# Altium schematic sheet ESP32_CUSTOM.SchDoc
size A2; SheetNumber: 1; SheetTotal: 1
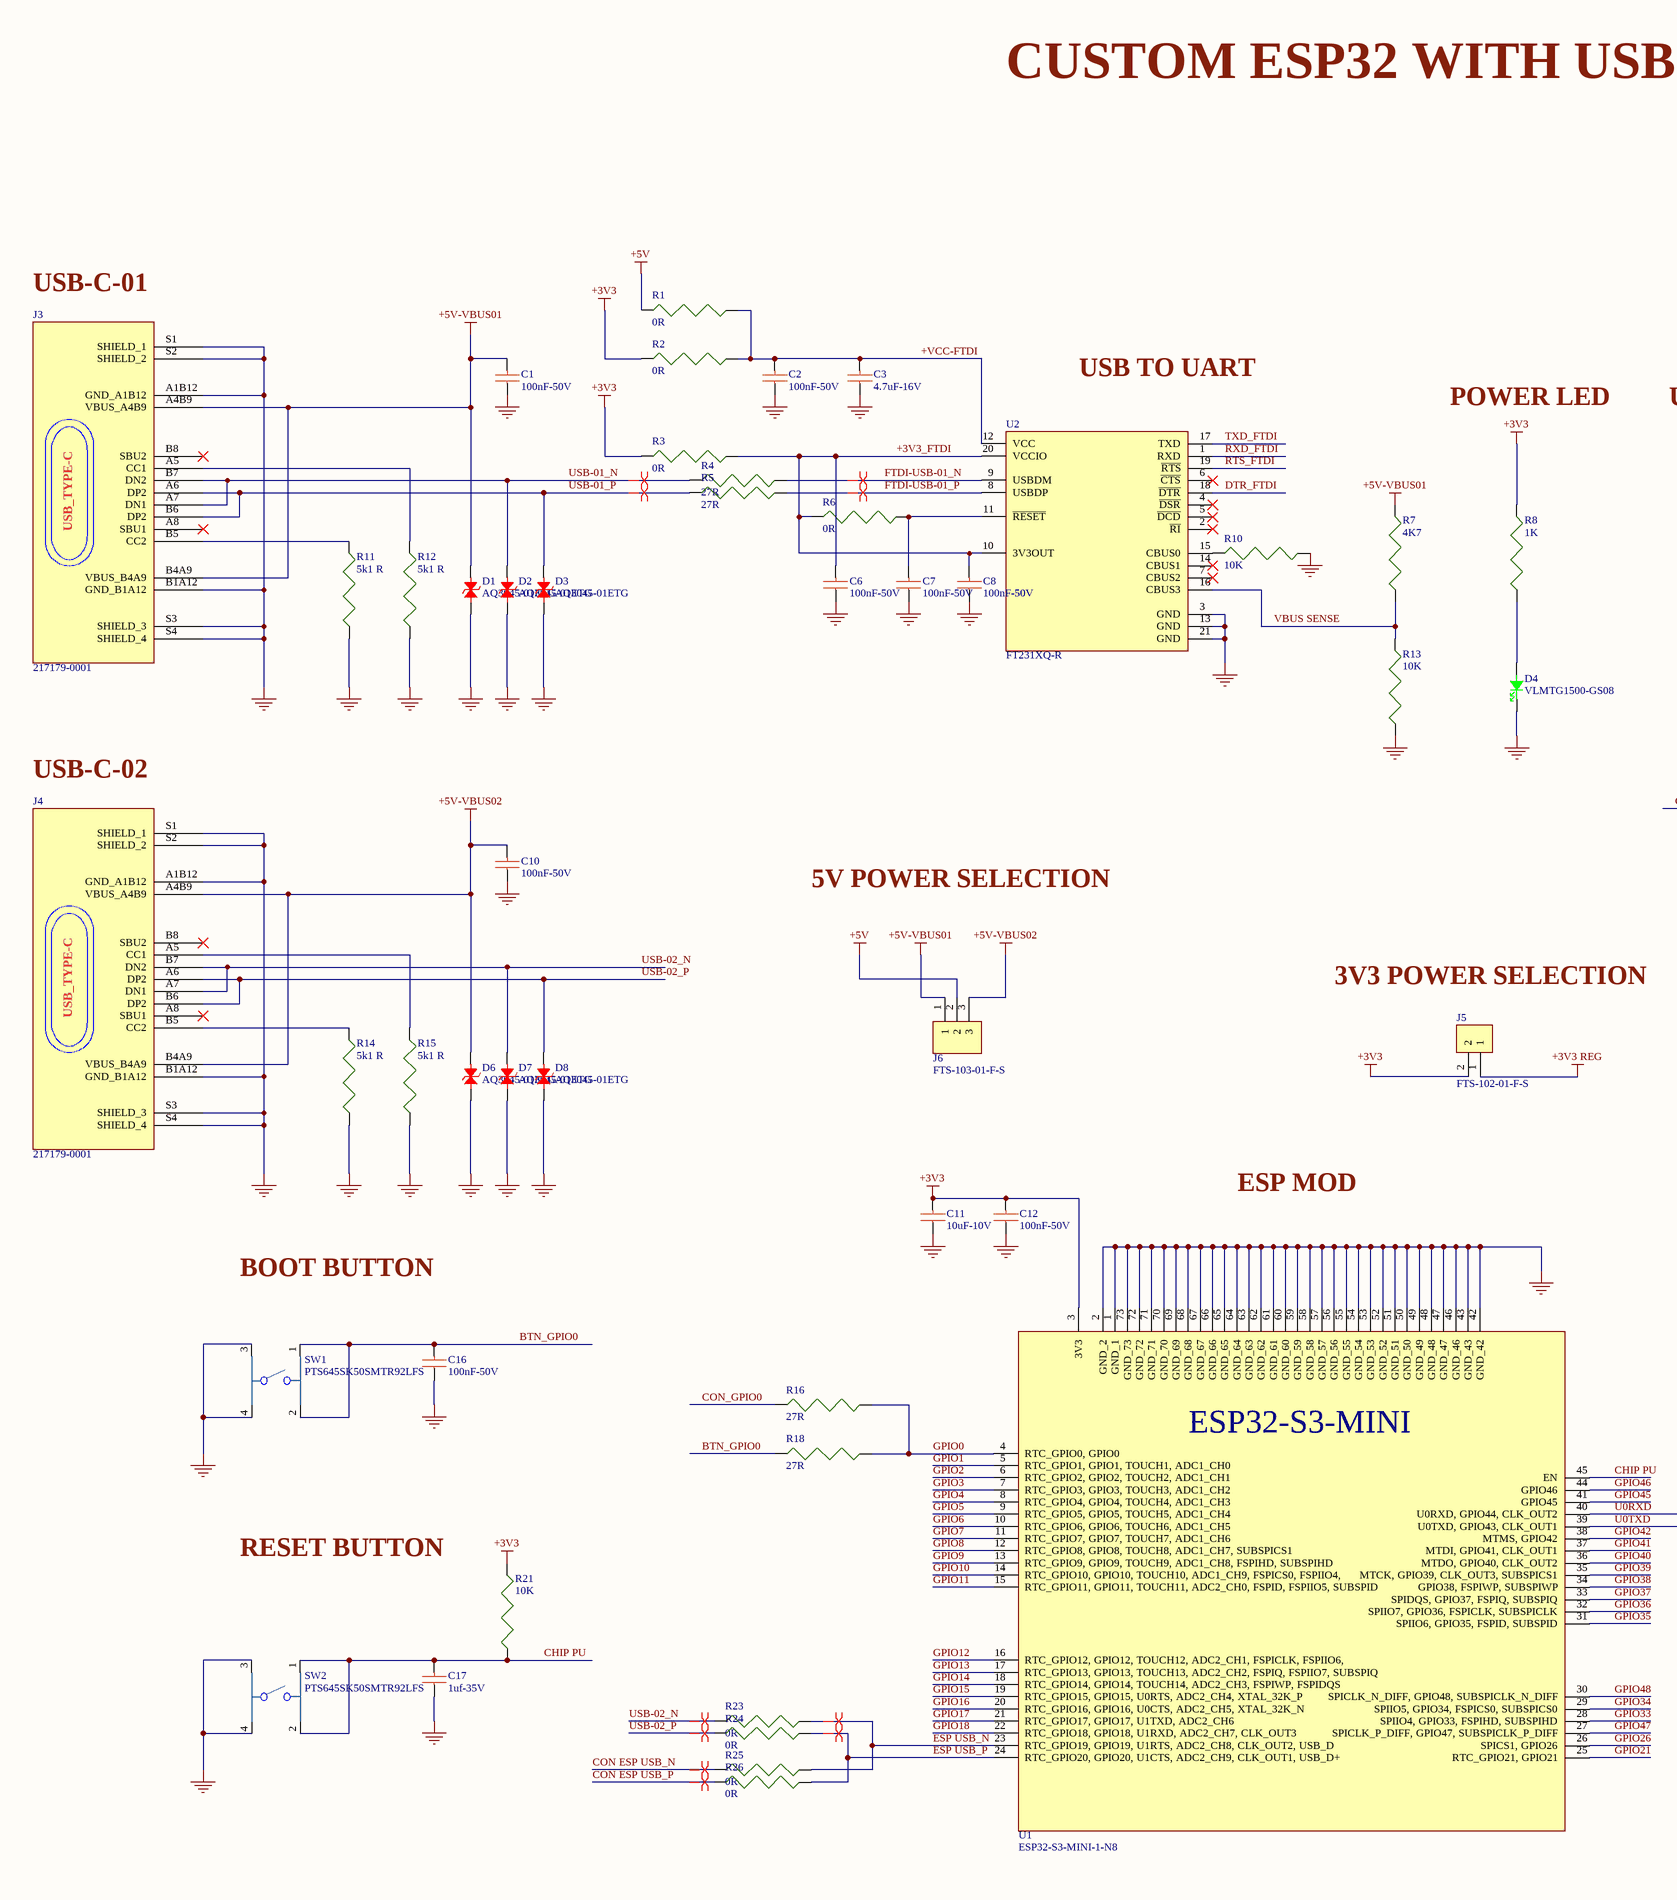
[diagram p0: ESP32_CUSTOM.SchDoc, left]
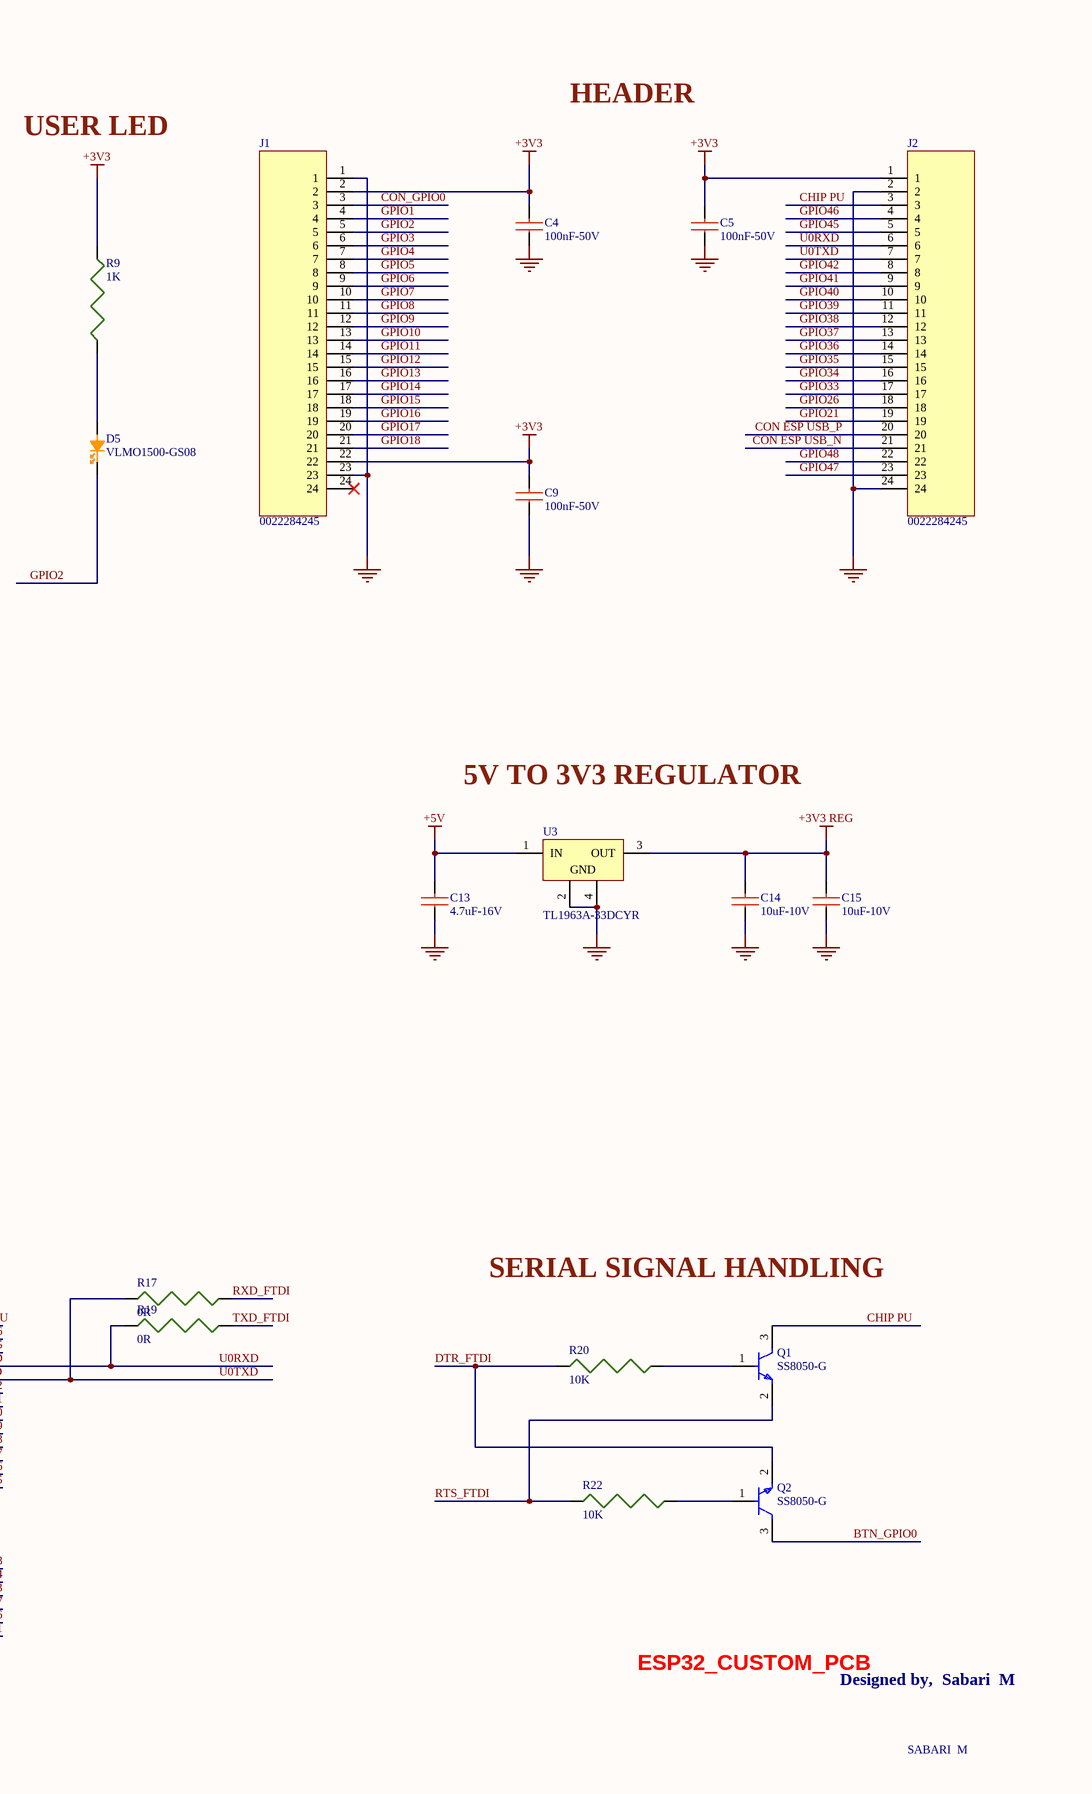
[diagram p1: ESP32_CUSTOM.SchDoc, right]

## Parts
C1  100nF-50V  [FP-CL829-IPC_B]
C2  100nF-50V  [FP-CL829-IPC_B]
C3  4.7uF-16V  [FP-CL829-IPC_B]
C4  100nF-50V  [FP-CL829-IPC_B]
C5  100nF-50V  [FP-CL829-IPC_B]
C6  100nF-50V  [FP-CL829-IPC_B]
C7  100nF-50V  [FP-CL829-IPC_B]
C8  100nF-50V  [FP-CL829-IPC_B]
C9  100nF-50V  [FP-CL829-IPC_B]
C10  100nF-50V  [FP-CL829-IPC_B]
C11  10uF-10V  [FP-CL829-IPC_B]
C12  100nF-50V  [FP-CL829-IPC_B]
C13  4.7uF-16V  [FP-CL829-IPC_B]
C14  10uF-10V  [FP-CL829-IPC_B]
C15  10uF-10V  [FP-CL829-IPC_B]
C16  100nF-50V  [FP-CL829-IPC_B]
C17  1uf-35V  [FP-CL829-IPC_B]
D1  AQ3045-01ETG  [SOD882]
D2  AQ3045-01ETG  [SOD882]
D3  AQ3045-01ETG  [SOD882]
D4  VLMTG1500-GS08  [FP-APG1005CGC-T-MFG]
D5  VLMO1500-GS08  [FP-VLMO1500-GS08-MFG]
D6  AQ3045-01ETG  [SOD882]
D7  AQ3045-01ETG  [SOD882]
D8  AQ3045-01ETG  [SOD882]
J1  0022284245  [HDR_1X24_2.54MM]
J2  0022284245  [HDR_1X24_2.54MM]
J3  217179-0001  [FP-2171790001-MFG]
J4  217179-0001  [FP-2171790001-MFG]
J5  FTS-102-01-F-S  [HDR_1X2_1.27MM]
J6  FTS-103-01-F-S  [HDR_1X3_1.27MM]
Q1  SS8050-G  [FP-SS8050-G-IPC_B]
Q2  SS8050-G  [FP-SS8050-G-IPC_B]
R1  0R  [FP-AC0402-IPC_A]
R2  0R  [FP-AC0402-IPC_A]
R3  0R  [FP-AC0402-IPC_A]
R4  27R  [FP-AC0402-IPC_A]
R5  27R  [FP-AC0402-IPC_A]
R6  0R  [FP-AC0402-IPC_A]
R7  4K7  [FP-AC0402-IPC_A]
R8  1K  [FP-AC0402-IPC_A]
R9  1K  [FP-AC0402-IPC_A]
R10  10K  [FP-AC0402-IPC_A]
R11  5k1 R  [FP-AC0402-IPC_A]
R12  5k1 R  [FP-AC0402-IPC_A]
R13  10K  [FP-AC0402-IPC_A]
R14  5k1 R  [FP-AC0402-IPC_A]
R15  5k1 R  [FP-AC0402-IPC_A]
R16  27R  [FP-AC0402-IPC_A]
R17  0R  [FP-AC0402-IPC_A]
R18  27R  [FP-AC0402-IPC_A]
R19  0R  [FP-AC0402-IPC_A]
R20  10K  [FP-AC0402-IPC_A]
R21  10K  [FP-AC0402-IPC_A]
R22  10K  [FP-AC0402-IPC_A]
R23  0R  [FP-AC0402-IPC_A]
R24  0R  [FP-AC0402-IPC_A]
R25  0R  [FP-AC0402-IPC_A]
R26  0R  [FP-AC0402-IPC_A]
SW1  PTS645SK50SMTR92LFS  [FP-PTS645SM43SMTR92LFS-MFG]
SW2  PTS645SK50SMTR92LFS  [FP-PTS645SM43SMTR92LFS-MFG]
U1  ESP32-S3-MINI-1-N8  [XCVR_ESP32-S3-MINI-1-N8]
U2  FT231XQ-R  [FP-QFN-20-IPC_B]
U3  TL1963A-33DCYR  [DCY0004A_N]

## Nets
+3V3: C4.2 C5.2 C9.2 C11.2 C12.2 J1.2 J1.22 J2.1 J5.2 R2.1 R3.1 R8.2 R9.2 R21.1 U1.3(3V3)
+3V3 REG: C14.2 C15.2 J5.1 U3.3(OUT)
+5V: C13.2 J6.2 R1.1 U3.1(IN)
+5V-VBUS01: C1.2 D1.1 J3.A4B9(VBUS_A4B9) J3.B4A9(VBUS_B4A9) J6.1 R7.2
+5V-VBUS02: C10.2 D6.1 J4.A4B9(VBUS_A4B9) J4.B4A9(VBUS_B4A9) J6.3
GND: C1.1 C2.1 C3.1 C4.1 C5.1 C6.1 C7.1 C8.1 C9.1 C10.1 C11.1 C12.1 C13.1 C14.1 C15.1 C16.1 C17.1 D1.2 D2.2 D3.2 D4.1 D6.2 D7.2 D8.2 J1.1 J1.23 J2.2 J2.24 J3.A1B12(GND_A1B12) J3.B1A12(GND_B1A12) J3.S1(SHIELD_1) J3.S2(SHIELD_2) J3.S3(SHIELD_3) J3.S4(SHIELD_4) J4.A1B12(GND_A1B12) J4.B1A12(GND_B1A12) J4.S1(SHIELD_1) J4.S2(SHIELD_2) J4.S3(SHIELD_3) J4.S4(SHIELD_4) R10.1 R11.1 R12.1 R13.1 R14.1 R15.1 SW1.3 SW1.4 SW2.3 SW2.4 U1.1(GND_1) U1.2(GND_2) U1.42(GND_42) U1.43(GND_43) U1.46(GND_46) U1.47(GND_47) U1.48(GND_48) U1.49(GND_49) U1.50(GND_50) U1.51(GND_51) U1.52(GND_52) U1.53(GND_53) U1.54(GND_54) U1.55(GND_55) U1.56(GND_56) U1.57(GND_57) U1.58(GND_58) U1.59(GND_59) U1.60(GND_60) U1.61(GND_61) U1.62(GND_62) U1.63(GND_63) U1.64(GND_64) U1.65(GND_65) U1.66(GND_66) U1.67(GND_67) U1.68(GND_68) U1.69(GND_69) U1.70(GND_70) U1.71(GND_71) U1.72(GND_72) U1.73(GND_73) U2.3(GND) U2.13(GND) U2.21(GND) U3.2(GND) U3.4(GND)
+3V3_FTDI: C6.2 C8.2 R3.2 R6.1 U2.10(3V3OUT) U2.20(VCCIO)
+VCC-FTDI: C2.2 C3.2 R1.2 R2.2 U2.12(VCC)
BTN_GPIO0: C16.2 Q2.3(C) R18.1 SW1.1 SW1.2
CHIP PU: C17.2 J2.3 Q1.3(C) R21.2 SW2.1 SW2.2 U1.45(EN)
CON ESP USB_N: J2.21 R25.1
CON ESP USB_P: J2.20 R26.1
CON_GPIO0: J1.3 R16.1
DTR_FTDI: Q2.2(E) R20.2 U2.18(~{DTR})
ESP USB_N: R23.2 R25.2 U1.23(RTC_GPIO19,_GPIO19,_U1RTS,_ADC2_CH8,_CLK_OUT2,_USB_D)
ESP USB_P: R24.2 R26.2 U1.24(RTC_GPIO20,_GPIO20,_U1CTS,_ADC2_CH9,_CLK_OUT1,_USB_D+)
FTDI-USB-01_N: R4.2 U2.9(USBDM)
FTDI-USB-01_P: R5.2 U2.8(USBDP)
GPIO0: R16.2 R18.2 U1.4(RTC_GPIO0,_GPIO0)
GPIO1: J1.4 U1.5(RTC_GPIO1,_GPIO1,_TOUCH1,_ADC1_CH0)
GPIO2: D5.1 J1.5 U1.6(RTC_GPIO2,_GPIO2,_TOUCH2,_ADC1_CH1)
GPIO3: J1.6 U1.7(RTC_GPIO3,_GPIO3,_TOUCH3,_ADC1_CH2)
GPIO4: J1.7 U1.8(RTC_GPIO4,_GPIO4,_TOUCH4,_ADC1_CH3)
GPIO5: J1.8 U1.9(RTC_GPIO5,_GPIO5,_TOUCH5,_ADC1_CH4)
GPIO6: J1.9 U1.10(RTC_GPIO6,_GPIO6,_TOUCH6,_ADC1_CH5)
GPIO7: J1.10 U1.11(RTC_GPIO7,_GPIO7,_TOUCH7,_ADC1_CH6)
GPIO8: J1.11 U1.12(RTC_GPIO8,_GPIO8,_TOUCH8,_ADC1_CH7,_SUBSPICS1)
GPIO9: J1.12 U1.13(RTC_GPIO9,_GPIO9,_TOUCH9,_ADC1_CH8,_FSPIHD,_SUBSPIHD)
GPIO10: J1.13 U1.14(RTC_GPIO10,_GPIO10,_TOUCH10,_ADC1_CH9,_FSPICS0,_FSPIIO4,)
GPIO11: J1.14 U1.15(RTC_GPIO11,_GPIO11,_TOUCH11,_ADC2_CH0,_FSPID,_FSPIIO5,_SUBSPID)
GPIO12: J1.15 U1.16(RTC_GPIO12,_GPIO12,_TOUCH12,_ADC2_CH1,_FSPICLK,_FSPIIO6,)
GPIO13: J1.16 U1.17(RTC_GPIO13,_GPIO13,_TOUCH13,_ADC2_CH2,_FSPIQ,_FSPIIO7,_SUBSPIQ)
GPIO14: J1.17 U1.18(RTC_GPIO14,_GPIO14,_TOUCH14,_ADC2_CH3,_FSPIWP,_FSPIDQS)
GPIO15: J1.18 U1.19(RTC_GPIO15,_GPIO15,_U0RTS,_ADC2_CH4,_XTAL_32K_P)
GPIO16: J1.19 U1.20(RTC_GPIO16,_GPIO16,_U0CTS,_ADC2_CH5,_XTAL_32K_N)
GPIO17: J1.20 U1.21(RTC_GPIO17,_GPIO17,_U1TXD,_ADC2_CH6)
GPIO18: J1.21 U1.22(RTC_GPIO18,_GPIO18,_U1RXD,_ADC2_CH7,_CLK_OUT3)
GPIO21: J2.19 U1.25(RTC_GPIO21,_GPIO21)
GPIO26: J2.18 U1.26(SPICS1,_GPIO26)
GPIO33: J2.17 U1.28(SPIIO4,_GPIO33,_FSPIHD,_SUBSPIHD)
GPIO34: J2.16 U1.29(SPIIO5,_GPIO34,_FSPICS0,_SUBSPICS0)
GPIO35: J2.15 U1.31(SPIIO6,_GPIO35,_FSPID,_SUBSPID)
GPIO36: J2.14 U1.32(SPIIO7,_GPIO36,_FSPICLK,_SUBSPICLK)
GPIO37: J2.13 U1.33(SPIDQS,_GPIO37,_FSPIQ,_SUBSPIQ)
GPIO38: J2.12 U1.34(GPIO38,_FSPIWP,_SUBSPIWP)
GPIO39: J2.11 U1.35(MTCK,_GPIO39,_CLK_OUT3,_SUBSPICS1)
GPIO40: J2.10 U1.36(MTDO,_GPIO40,_CLK_OUT2)
GPIO41: J2.9 U1.37(MTDI,_GPIO41,_CLK_OUT1)
GPIO42: J2.8 U1.38(MTMS,_GPIO42)
GPIO45: J2.5 U1.41(GPIO45)
GPIO46: J2.4 U1.44(GPIO46)
GPIO47: J2.23 U1.27(SPICLK_P_DIFF,_GPIO47,_SUBSPICLK_P_DIFF)
GPIO48: J2.22 U1.30(SPICLK_N_DIFF,_GPIO48,_SUBSPICLK_N_DIFF)
RTS_FTDI: Q1.2(E) R22.2 U2.19(~{RTS})
RXD_FTDI: R17.2 U2.1(RXD)
TXD_FTDI: R19.2 U2.17(TXD)
U0RXD: J2.6 R19.1 U1.40(U0RXD,_GPIO44,_CLK_OUT2)
U0TXD: J2.7 R17.1 U1.39(U0TXD,_GPIO43,_CLK_OUT1)
USB-01_N: D2.1 J3.A7(DN1) J3.B7(DN2) R4.1
USB-01_P: D3.1 J3.A6(DP2) J3.B6(DP2) R5.1
USB-02_N: D7.1 J4.A7(DN1) J4.B7(DN2) R23.1
USB-02_P: D8.1 J4.A6(DP2) J4.B6(DP2) R24.1
VBUS SENSE: R7.1 R13.2 U2.16(CBUS3)
NetC7_2: C7.2 R6.2 U2.11(~{RESET})
NetD4_2: D4.2 R8.1
NetD5_2: D5.2 R9.1
NetJ3_A5: J3.A5(CC1) R12.2
NetJ3_B5: J3.B5(CC2) R11.2
NetJ4_A5: J4.A5(CC1) R15.2
NetJ4_B5: J4.B5(CC2) R14.2
NetQ1_1: Q1.1(B) R20.1
NetQ2_1: Q2.1(B) R22.1
NetR10_2: R10.2 U2.15(CBUS0)

Not connected (* = marked no-connect by the designer): J1 24*; J3 A8(SBU1)* B8(SBU2)*; J4 A8(SBU1)* B8(SBU2)*; U2 2(~{RI})* 4(~{DSR})* 5(~{DCD})* 6(~{CTS})* 7(CBUS2)* 14(CBUS1)*

## Layout directives
differential pair; differential pair class DIFF90: CON ESP USB_N, CON ESP USB_P, ESP USB_N, ESP USB_P, FTDI-USB-01_N, FTDI-USB-01_P, USB-01_N, USB-01_P, USB-02_N, USB-02_P

## Notes on the sheet
- CUSTOM ESP32 WITH USB-C
- USB-C-01
- USB TO UART
- POWER LED
- USER LED
- HEADER
- USB-C-02
- 5V POWER SELECTION
- 3V3 POWER SELECTION
- 5V TO 3V3 REGULATOR
- ESP MOD
- BOOT BUTTON
- SERIAL SIGNAL HANDLING
- RESET BUTTON
- ESP32_CUSTOM_PCB
- Designed by,  Sabari  M
- SABARI  M
- (in symbol 217179-0001) USB_TYPE-C
- (in symbol ESP32-S3-MINI-1-N8) ESP32-S3-MINI

## Library data of the parts
C1 C2 C4-C10 C12 C16 = CL05B104KB54PNC: CAP CER 0.1UF 50V X7R 0402; Manufacturer: Samsung; Dielectric Material: Ceramic; Supplier: Digikey; Supplier Part Number: 1276-CL05B104KB54PNCCT-ND; Manufacturer Part Number: CL05B104KB54PNC; RoHS: Yes; Category: Ceramic Capacitors; Stock: 1677600; Pricing: 1=0.1, 10=0.036, 50=0.0244, 100=0.0209, 500=0.01492, 1000=0.01307, 2500=0.0111, 5000=0.00992 (USD); Pins: 2; Capacitor Type: Ceramic; RoHS Compliant: Yes; Reach SVHC Compliant: Yes; ComponentLink1URL: https://datasheet.ciiva.com:443/pdfs/VipMasterIC/IC/SEMS/SEMS-S-A0006318249/SEMS-S-A0006320959-1.pdf?src-supplier=IHS+Markit; ComponentLink1Description: https://datasheet.ciiva.com:443/pdfs/VipMasterIC/IC/SEMS/SEMS-S-A0006318249/SEMS-S-A0006320959-1.pdf?src-supplier=IHS+Markit; ComponentLink2URL: https://datasheet.octopart.com/CL05B104KB54PNC-Samsung-datasheet-8326407.pdf?src-supplier=TME; ComponentLink2Description: https://datasheet.octopart.com/CL05B104KB54PNC-Samsung-datasheet-8326407.pdf?src-supplier=TME; LCSC Part Number: C3073311
C3 C13 = CL05A475MO5NUNC: CAP CER 4.7UF 16V X5R 0402; Manufacturer: Samsung; Dielectric Material: Ceramic; Multilayer: Yes; Tolerance  (fill in as +-): 20%; Supplier: Digikey; Supplier Part Number: 1276-6836-1-ND; Manufacturer Part Number: CL05A475MO5NUNC; RoHS: Yes; Category: Ceramic Capacitors; Stock: 109140; Pricing: 1=0.31, 10=0.146, 50=0.1232, 100=0.1, 500=0.0952, 1000=0.0904, 2500=0.0752, 10000=0.07123 (USD); Mounting Technology: Surface Mount; Pins: 2; Package Shape: Rectangular; Case/Package: 0402; Terminal Finish: Nickel; Min Operating Temperature: -55°C; Max Operating Temperature: 85°C; JESD-609 Code: e3; Value: 4.7uF; Capacitor Type: Ceramic; Package Style: SMTMeter; Packaging: Tape and Reel; Tolerance (fill in as +-): 20%; Rated DC Voltage (URdc): 16V; Temperature Characteristics Code: X5R; Termination: Wraparound; Length: 1mm; Width: 0.5mm; Height: 0.7mm; Reach SVHC Compliant: Yes; RoHS Compliant: Yes; ComponentLink1URL: https://datasheet.ciiva.com:443/pdfs/VipMasterIC/IC/SEMS/SEMS-S-A0008384515/SEMS-S-A0008898881-1.pdf?src-supplier=IHS+Markit; ComponentLink1Description: https://datasheet.ciiva.com:443/pdfs/VipMasterIC/IC/SEMS/SEMS-S-A0008384515/SEMS-S-A0008898881-1.pdf?src-supplier=IHS+Markit; ComponentLink2URL: http://www.farnell.com/datasheets/2710653.pdf?src-supplier=Farnell; ComponentLink2Description: http://www.farnell.com/datasheets/2710653.pdf?src-supplier=Farnell; ComponentLink3URL: http://www.samsungsem.com/kr/support/product-search/mlcc/CL05A475MO5NUNC.jsp?src-supplier=Digikey; ComponentLink3Description: http://www.samsungsem.com/kr/support/product-search/mlcc/CL05A475MO5NUNC.jsp?src-supplier=Digikey; ComponentLink4URL: http://www.farnell.com/datasheets/2710653.pdf?src-supplier=Newark; ComponentLink4Description: http://www.farnell.com/datasheets/2710653.pdf?src-supplier=Newark; ComponentLink5URL: http://www.farnell.com/datasheets/2710653.pdf?src-supplier=Element14; ComponentLink5Description: http://www.farnell.com/datasheets/2710653.pdf?src-supplier=Element14; LCSC Part Number: C318563
C11 C14 C15 = CL05A106MP8NUB8: CAP CER 10UF 10V X5R 0402; Manufacturer: Samsung; Dielectric Material: Ceramic; Multilayer: Yes; Tolerance  (fill in as +-): 20%; Supplier: Digikey; Supplier Part Number: 1276-6830-1-ND; Manufacturer Part Number: CL05A106MP8NUB8; RoHS: Yes; Category: Ceramic Capacitors; Stock: 450449; Pricing: 1=0.26, 10=0.127, 50=0.1044, 100=0.0816, 500=0.0752, 1000=0.0688, 2500=0.0584, 8000=0.056 (USD); Mounting Technology: Surface Mount; Pins: 2; Package Shape: Rectangular; Case/Package: 0402; Terminal Finish: Nickel; Min Operating Temperature: -55°C; Max Operating Temperature: 85°C; JESD-609 Code: e3; Value: 10uF; Capacitor Type: Ceramic; Packaging: Tape and Reel; Tolerance (fill in as +-): 20%; Rated DC Voltage (URdc): 10V; Temperature Characteristics Code: X5R; Termination: Wraparound; Reach SVHC Compliant: Yes; RoHS Compliant: Yes; ComponentLink1URL: https://datasheet.ciiva.com:443/pdfs/VipMasterIC/IC/SEMS/SEMS-S-A0008521219/SEMS-S-A0008521325-1.pdf?src-supplier=IHS+Markit; ComponentLink1Description: https://datasheet.ciiva.com:443/pdfs/VipMasterIC/IC/SEMS/SEMS-S-A0008521219/SEMS-S-A0008521325-1.pdf?src-supplier=IHS+Markit; ComponentLink2URL: http://www.samsungsem.com/kr/support/product-search/mlcc/CL05A106MP8NUB8.jsp?src-supplier=Digikey; ComponentLink2Description: http://www.samsungsem.com/kr/support/product-search/mlcc/CL05A106MP8NUB8.jsp?src-supplier=Digikey; ComponentLink3URL: https://datasheet.octopart.com/CL05A106MP8NUB8-Samsung-Electro-Mechanics-datasheet-136460857.pdf?src-supplier=Future+Electronics; ComponentLink3Description: https://datasheet.octopart.com/CL05A106MP8NUB8-Samsung-Electro-Mechanics-datasheet-136460857.pdf?src-supplier=Future+Electronics; LCSC Part Number: C307415
C17 = CL05A105KL5NRNC: CAP CER 1UF 35V X5R 0402; Manufacturer: Samsung; Dielectric Material: Ceramic; Multilayer: Yes; Tolerance  (fill in as +-): 10%; Supplier: Digikey; Supplier Part Number: 1276-6796-1-ND; Manufacturer Part Number: CL05A105KL5NRNC; RoHS: Yes; Category: Ceramic Capacitors; Stock: 279594; Pricing: 1=0.31, 10=0.181, 50=0.1296, 100=0.1136, 500=0.08658, 1000=0.07816, 2500=0.06921, 5000=0.06379 (USD); Mounting Technology: Surface Mount; Pins: 2; Package Shape: Rectangular; Case/Package: 0402; Terminal Finish: Nickel; Min Operating Temperature: -55°C; Max Operating Temperature: 85°C; JESD-609 Code: e3; Value: 1uF; Capacitor Type: Ceramic; Packaging: Tape and Reel; Tolerance (fill in as +-): 10%; Rated DC Voltage (URdc): 35V; Temperature Characteristics Code: X5R; Termination: Wraparound; Reach SVHC Compliant: Yes; RoHS Compliant: Yes; ComponentLink1URL: https://datasheet.ciiva.com:443/pdfs/VipMasterIC/IC/SEMS/SEMS-S-A0008384515/SEMS-S-A0008872905-1.pdf?src-supplier=IHS+Markit; ComponentLink1Description: https://datasheet.ciiva.com:443/pdfs/VipMasterIC/IC/SEMS/SEMS-S-A0008384515/SEMS-S-A0008872905-1.pdf?src-supplier=IHS+Markit; ComponentLink2URL: http://www.samsungsem.com/kr/support/product-search/mlcc/CL05A105KL5NRNC.jsp?src-supplier=Digikey; ComponentLink2Description: http://www.samsungsem.com/kr/support/product-search/mlcc/CL05A105KL5NRNC.jsp?src-supplier=Digikey; LCSC Part Number: C307413
D1-D3 D6-D8 = AQ3045-01ETG: TVS DIODE 5.3VWM 12VC SOD882; Manufacturer: Littelfuse; Diode Element Material: SILICON; Package Body Material: Plastic; Polarity: Bidirectional; Max Breakdown Voltage: 9V; Min Breakdown Voltage: 6.8V; Diode Type: TRANS VOLTAGE SUPPRESSOR; Non-rep Peak Rev Power Dis-Max: 40W; Number of Elements: 1; Rep Pk Reverse Voltage-Max: 5.3V; Reference Standard: AEC-Q101; Supplier: Digikey; Supplier Part Number: F9321CT-ND; Manufacturer Part Number: AQ3045-01ETG; RoHS: Yes; Category: TVS Diodes; Stock: 16770; Pricing: 1=0.48, 10=0.321, 100=0.17, 500=0.152, 1000=0.134, 2000=0.13, 5000=0.126 (USD); Pins: 2; Package Shape: Rectangular; Min Operating Temperature: -55°C; Max Operating Temperature: 150°C; Package Style: CHIP CARRIERMeter; Surface Mount: Yes; Technology: AVALANCHE; Terminal Form: No Lead; Terminal Position: BOTTOM; Reach SVHC Compliant: Yes; RoHS Compliant: Yes; ComponentLink1URL: https://datasheet.ciiva.com:443/pdfs/VipMasterIC/IC/LFSI/LFSI-S-A0007892042/LFSI-S-A0007892042-1.pdf?src-supplier=IHS+Markit; ComponentLink1Description: https://datasheet.ciiva.com:443/pdfs/VipMasterIC/IC/LFSI/LFSI-S-A0007892042/LFSI-S-A0007892042-1.pdf?src-supplier=IHS+Markit; ComponentLink2URL: https://www.littelfuse.com/~/media/electronics/datasheets/tvs_diode_arrays/littelfuse_tvs_diode_array_aq3045_datasheet.pdf.pdf?src-supplier=Digikey; ComponentLink2Description: https://www.littelfuse.com/~/media/electronics/datasheets/tvs_diode_arrays/littelfuse_tvs_diode_array_aq3045_datasheet.pdf.pdf?src-supplier=Digikey; ComponentLink3URL: http://www.littelfuse.com/~/media/electronics/datasheets/tvs_diode_arrays/littelfuse_tvs_diode_array_aq3045_datasheet.pdf.pdf?src-supplier=Digikey; ComponentLink3Description: http://www.littelfuse.com/~/media/electronics/datasheets/tvs_diode_arrays/littelfuse_tvs_diode_array_aq3045_datasheet.pdf.pdf?src-supplier=Digikey; LCSC Part Number: C3710326
D4 = VLMTG1500-GS08: LED GREEN 0402 SMD; Manufacturer: Vishay; Optoelectronic Device Type: SINGLE COLOR LED; Supplier: Mouser; Supplier Part Number: 78-VLMTG1500-GS08; Manufacturer Part Number: VLMTG1500-GS08; RoHS: Yes; Category: LEDs; Stock: 9688; Pricing: 1=0.43, 10=0.247, 50=0.247, 100=0.12, 1000=0.11, 10000=0.079 (USD); RoHS Compliant: Yes; ComponentLink1URL: https://datasheet.ciiva.com:443/pdfs/VipMasterIC/IC/VISH/VISH-S-A0003457490/VISH-S-A0003457490-1.pdf?src-supplier=IHS+Markit; ComponentLink1Description: https://datasheet.ciiva.com:443/pdfs/VipMasterIC/IC/VISH/VISH-S-A0003457490/VISH-S-A0003457490-1.pdf?src-supplier=IHS+Markit; LCSC Part Number: C20346084
D5 = VLMO1500-GS08: LED ORANGE 0402 SMD; Manufacturer: Vishay; Shape: Rectangular; Forward Current: 30mA; Forward Voltage: 2.4V; Luminous Intensity-Nom: 90mcd; Channels: 1; Optoelectronic Device Type: SINGLE COLOR LED; Reverse Voltage-Max: 5V; Viewing Angle: 130°; Overall Height: 0.35mm; Supplier: Mouser; Supplier Part Number: 78-VLMO1500-GS08; Manufacturer Part Number: VLMO1500-GS08; RoHS: Yes; Category: LEDs; Stock: 1245; Pricing: 1=0.32, 10=0.189, 50=0.189, 100=0.089, 1000=0.078, 10000=0.058 (USD); Mounting Technology: Surface Mount; Pins: 2; Color: Orange; Color@wavelength: Orange; Min Operating Temperature: -30°C; Max Operating Temperature: 85°C; Packaging: Tape and Reel; Size: 0.5mm; Terminal Pitch: 0.95mm; Reach SVHC Compliant: Yes; RoHS Compliant: Yes; ComponentLink1URL: https://datasheet.ciiva.com:443/pdfs/VipMasterIC/IC/VISH/VISH-S-A0003457490/VISH-S-A0003457490-1.pdf?src-supplier=IHS+Markit; ComponentLink1Description: https://datasheet.ciiva.com:443/pdfs/VipMasterIC/IC/VISH/VISH-S-A0003457490/VISH-S-A0003457490-1.pdf?src-supplier=IHS+Markit; ComponentLink2URL: https://datasheet.ciiva.com/13945/vlmo1500-13945355.pdf?src-supplier=Digikey; ComponentLink2Description: https://datasheet.ciiva.com/13945/vlmo1500-13945355.pdf?src-supplier=Digikey; ComponentLink3URL: https://datasheet.ciiva.com/13945/vlmo1500-13945356.pdf?src-supplier=Digikey; ComponentLink3Description: https://datasheet.ciiva.com/13945/vlmo1500-13945356.pdf?src-supplier=Digikey; ComponentLink4URL: https://datasheet.ciiva.com/13945/vlmo1500-13945357.pdf?src-supplier=Digikey; ComponentLink4Description: https://datasheet.ciiva.com/13945/vlmo1500-13945357.pdf?src-supplier=Digikey; LCSC Part Number: C3000857
J1 J2 = 0022284245: CONN HEADER VERT 24POS 2.54MM; Manufacturer: Molex; Connector Type: BOARD CONNECTOR; Option: General Purpose; Filter Feature: No; Mating Information: MULTIPLE MATING PARTS AVAILABLE; Number of Rows Loaded: 1; Number of Contacts: 24; Supplier: Mouser; Supplier Part Number: 538-22-28-4245; Manufacturer Part Number: 0022284245; RoHS: Yes; Category: Uncategorized; Stock: 293; Pricing: 1=1.45, 10=1.1, 50=1.1, 100=0.85, 1000=0.735, 10000=0.735 (USD); Mounting Technology: Board; Contact Material: Brass; Contact Finish - Mating: GOLD; Contact Finish - Termination: Tin (Sn); JESD-609 Code: e3; Contact Gender: Male; Mixed Contacts: No; Mounting Style: STRAIGHT; Termination: Solder; Terminal Pitch: 2.54mm; Flammability Rating: UL94 V-0; DIN Conformance: No; IEC Conformance: No; MIL Conformance: No; Reach SVHC Compliant: Yes; RoHS Compliant: Yes; ComponentLink1URL: https://datasheet.ciiva.com:443/pdfs/VipMasterIC/IC/MOLE/MOLE-S-A0006764423/MOLE-S-A0006877704-1.pdf?src-supplier=IHS+Markit; ComponentLink1Description: https://datasheet.ciiva.com:443/pdfs/VipMasterIC/IC/MOLE/MOLE-S-A0006764423/MOLE-S-A0006877704-1.pdf?src-supplier=IHS+Markit; ComponentLink2URL: https://datasheet.ciiva.com/6814/022284363-sd-6814049.pdf?src-supplier=Digikey; ComponentLink2Description: https://datasheet.ciiva.com/6814/022284363-sd-6814049.pdf?src-supplier=Digikey; ComponentLink3URL: https://datasheet.ciiva.com/10075/0022284245-pcb-headers-10075617.pdf?src-supplier=Avnet; ComponentLink3Description: https://datasheet.ciiva.com/10075/0022284245-pcb-headers-10075617.pdf?src-supplier=Avnet; ComponentLink4URL: https://datasheet.ciiva.com/5153/0022284245-pcb-headers-228340-5153875.pdf?src-supplier=Mouser; ComponentLink4Description: https://datasheet.ciiva.com/5153/0022284245-pcb-headers-228340-5153875.pdf?src-supplier=Mouser; ComponentLink5URL: https://datasheet.ciiva.com/1433/1597854-1433759.pdf?src-supplier=Element14; ComponentLink5Description: https://datasheet.ciiva.com/1433/1597854-1433759.pdf?src-supplier=Element14; LCSC Part Number: C7145888
J3 J4 = 217179-0001: CONN RCP USB2.0 TYP C 24P SMD RA; Manufacturer: Molex; Supplier: Digikey; Supplier Part Number: 900-2171790001CT-ND; Manufacturer Part Number: 217179-0001; RoHS: No; Category: Connectors; Stock: 13851; Pricing: 1=0.98, 10=0.731, 25=0.6564, 50=0.6074, 100=0.5642, 250=0.51468, 500=0.48234 (USD); LCSC Part Number: C3197684
J5 = FTS-102-01-F-S: CONN HEADER VERT 2POS 1.27MM; Manufacturer: Samtec; Manufacturer Series: FTS; Connector Type: BOARD CONNECTOR; Option: General Purpose; Additional Feature: Low Profile; Filter Feature: No; Number of Rows Loaded: 1; Number of Contacts: 2; Supplier: Digikey; Supplier Part Number: SAM15176-ND; Manufacturer Part Number: FTS-102-01-F-S; RoHS: Yes; Category: Connectors; Stock: 422; Pricing: 1=0.49, 50=0.4252, 100=0.3608, 500=0.2994, 1000=0.25609, 2000=0.20954, 5000=0.16589, 10000=0.1625 (USD); Mounting Technology: Board; Contact Material: Bronze; Contact Finish - Mating: GOLD (3) OVER NICKEL (50); Contact Finish - Termination: Matte Tin (Sn) - with Nickel (Ni) barrier; JESD-609 Code: e3; Contact Gender: Male; Mixed Contacts: No; Mounting Style: STRAIGHT; Termination: Solder; Terminal Pitch: 1.27mm; Flammability Rating: UL94 V-0; DIN Conformance: No; IEC Conformance: No; MIL Conformance: No; Reach SVHC Compliant: Yes; RoHS Compliant: Yes; ComponentLink1URL: https://datasheet.ciiva.com:443/pdfs/VipMasterIC/IC/SAMI/SAMI-S-A0001504673/SAMI-S-A0001504673-1.pdf?src-supplier=IHS+Markit; ComponentLink1Description: https://datasheet.ciiva.com:443/pdfs/VipMasterIC/IC/SAMI/SAMI-S-A0001504673/SAMI-S-A0001504673-1.pdf?src-supplier=IHS+Markit; ComponentLink2URL: http://www.samtec.com/documents/webfiles/pdf/FTS.pdf?src-supplier=Avnet; ComponentLink2Description: http://www.samtec.com/documents/webfiles/pdf/FTS.pdf?src-supplier=Avnet; LCSC Part Number: C6045317
J6 = FTS-103-01-F-S: CONN HEADER VERT 3POS 1.27MM; Manufacturer: Samtec; Manufacturer Series: FTS; Connector Type: BOARD CONNECTOR; Option: General Purpose; Additional Feature: Low Profile; Filter Feature: No; Number of Rows Loaded: 1; Number of Contacts: 3; Supplier: Digikey; Supplier Part Number: 612-FTS-103-01-F-S-ND; Manufacturer Part Number: FTS-103-01-F-S; RoHS: Yes; Category: Connectors; Stock: 2615; Pricing: 1=0.73, 50=0.6378, 100=0.5407, 500=0.4491, 1000=0.38362, 2000=0.31431, 5000=0.2478, 10000=0.2375 (USD); Mounting Technology: Board; Contact Material: Bronze; Contact Finish - Mating: GOLD (3) OVER NICKEL (50); Contact Finish - Termination: Matte Tin (Sn) - with Nickel (Ni) barrier; JESD-609 Code: e3; Contact Gender: Male; Mixed Contacts: No; Mounting Style: STRAIGHT; Termination: Solder; Terminal Pitch: 1.27mm; Flammability Rating: UL94 V-0; DIN Conformance: No; IEC Conformance: No; MIL Conformance: No; Reach SVHC Compliant: Yes; RoHS Compliant: Yes; ComponentLink1URL: https://datasheet.ciiva.com:443/pdfs/VipMasterIC/IC/SAMI/SAMI-S-A0001504673/SAMI-S-A0001504673-1.pdf?src-supplier=IHS+Markit; ComponentLink1Description: https://datasheet.ciiva.com:443/pdfs/VipMasterIC/IC/SAMI/SAMI-S-A0001504673/SAMI-S-A0001504673-1.pdf?src-supplier=IHS+Markit; ComponentLink2URL: http://suddendocs.samtec.com/prints/fts-1xx-xx-xx-xx-xx-mkt.pdf?src-supplier=Digikey; ComponentLink2Description: http://suddendocs.samtec.com/prints/fts-1xx-xx-xx-xx-xx-mkt.pdf?src-supplier=Digikey; ComponentLink3URL: http://www.samtec.com/documents/webfiles/pdf/FTS.pdf?src-supplier=Avnet; ComponentLink3Description: http://www.samtec.com/documents/webfiles/pdf/FTS.pdf?src-supplier=Avnet; ComponentLink4URL: https://datasheet.octopart.com/FTS-103-01-F-S-Samtec-datasheet-116535195.pdf?src-supplier=Toby+Electronics; ComponentLink4Description: https://datasheet.octopart.com/FTS-103-01-F-S-Samtec-datasheet-116535195.pdf?src-supplier=Toby+Electronics; ComponentLink5URL: https://datasheet.octopart.com/FTS-103-01-F-S-Samtec-datasheet-151470456.pdf?src-supplier=Sager+Electronics; ComponentLink5Description: https://datasheet.octopart.com/FTS-103-01-F-S-Samtec-datasheet-151470456.pdf?src-supplier=Sager+Electronics; LCSC Part Number: C3333578
Q1 Q2 = SS8050-G: TRANS NPN 25V 1.5A SOT23-3; Manufacturer: Comchip; Supplier: Digikey; Supplier Part Number: 641-1790-1-ND; Manufacturer Part Number: SS8050-G; RoHS: Yes; Category: Transistors; Stock: 74106; Pricing: 1=0.24, 10=0.148, 100=0.0921, 500=0.06754, 1000=0.05958, 3000=0.04941, 6000=0.04428, 9000=0.04166, 15000=0.03872, 21000=0.03697, 30000=0.03527, 75000=0.03155, 150000=0.02924, 300000=0.0275 (USD); Reach SVHC Compliant: Yes; RoHS Compliant: Yes; ComponentLink1URL: https://datasheet.ciiva.com:443/pdfs/VipMasterIC/IC/COMC/COMC-S-A0004994192/COMC-S-A0004994192-1.pdf?src-supplier=IHS+Markit; ComponentLink1Description: https://datasheet.ciiva.com:443/pdfs/VipMasterIC/IC/COMC/COMC-S-A0004994192/COMC-S-A0004994192-1.pdf?src-supplier=IHS+Markit; ComponentLink2URL: http://www.comchiptech.com/admin/files/product/SS8050-G RevA181526.pdf?src-supplier=Digikey; ComponentLink2Description: http://www.comchiptech.com/admin/files/product/SS8050-G RevA181526.pdf?src-supplier=Digikey; LCSC Part Number: C164886
R1-R3 R6 R17 R19 R23-R26 = RC0402JR-070RL: RES 0 OHM JUMPER 1/16W 0402; Manufacturer: Yageo; Power: 62.5mW; Rated Temperature: 70°C; Package Height: 0.35mm; Package Length: 1mm; Package Width: 0.5mm; Supplier: Future Electronics; Supplier Part Number: 3375797; Manufacturer Part Number: RC0402JR-070RL; RoHS: Yes; Category: Chip SMD Resistors; Stock: 3750000; Pricing: 10000=0.0006 (USD); Mounting Technology: Surface Mount; Pins: 2; Package Shape: Rectangular; Case/Package: 0402; Terminal Finish: Nickel; Min Operating Temperature: -55°C; Max Operating Temperature: 155°C; JESD-609 Code: e3; Resistor Type: FIXED RESISTOR; Construction: Chip; Packaging: Tape and Reel; Value: 0R; Technology: METAL GLAZE/THICK FILM; Termination: Wraparound; Reach SVHC Compliant: Yes; RoHS Compliant: Yes; ComponentLink1URL: https://datasheet.ciiva.com:443/pdfs/VipMasterIC/IC/YAGO/YAGO-S-A0008145938/YAGO-S-A0008145938-1.pdf?src-supplier=IHS+Markit; ComponentLink1Description: https://datasheet.ciiva.com:443/pdfs/VipMasterIC/IC/YAGO/YAGO-S-A0008145938/YAGO-S-A0008145938-1.pdf?src-supplier=IHS+Markit; LCSC Part Number: C60485
R4 R5 R16 R18 = RC0402FR-0727RL: RES 27 OHM 1% 1/16W 0402; Manufacturer: Yageo; Additional Feature: LASER TRIMMABLE; Power: 62.5mW; Rated Temperature: 70°C; Working Voltage: 50V; Temperature Coefficient (ppm/Cel): 100; Package Height: 0.35mm; Package Length: 1mm; Package Width: 0.5mm; Supplier: Digikey; Supplier Part Number: YAG3086DKR-ND; Manufacturer Part Number: RC0402FR-0727RL; RoHS: Yes; Category: Chip SMD Resistors; Stock: 316648; Pricing: 1=0.1, 10=0.009, 50=0.0072, 100=0.0051, 500=0.00408, 5000=0.00306 (USD); Mounting Technology: Surface Mount; Pins: 2; Package Shape: Rectangular; Case/Package: 0402; Terminal Finish: Nickel; Min Operating Temperature: -55°C; Max Operating Temperature: 155°C; Tolerance: 1%; JESD-609 Code: e3; Resistor Type: FIXED RESISTOR; Construction: Chip; Packaging: Tape and Reel; Value: 27R; Technology: METAL GLAZE/THICK FILM; Termination: Wraparound; Reach SVHC Compliant: Yes; RoHS Compliant: Yes; ComponentLink1URL: https://datasheet.ciiva.com:443/pdfs/VipMasterIC/IC/YAGO/YAGO-S-A0008145938/YAGO-S-A0008145938-1.pdf?src-supplier=IHS+Markit; ComponentLink1Description: https://datasheet.ciiva.com:443/pdfs/VipMasterIC/IC/YAGO/YAGO-S-A0008145938/YAGO-S-A0008145938-1.pdf?src-supplier=IHS+Markit; ComponentLink2URL: https://datasheet.ciiva.com/11808/0900766b80c66297-11808450.pdf?src-supplier=Rs; ComponentLink2Description: https://datasheet.ciiva.com/11808/0900766b80c66297-11808450.pdf?src-supplier=Rs; ComponentLink3URL: https://datasheet.ciiva.com/7849/1018594-7849927.pdf?src-supplier=Element14; ComponentLink3Description: https://datasheet.ciiva.com/7849/1018594-7849927.pdf?src-supplier=Element14; ComponentLink4URL: https://datasheet.ciiva.com/7849/1018594-7849926.pdf?src-supplier=Element14; ComponentLink4Description: https://datasheet.ciiva.com/7849/1018594-7849926.pdf?src-supplier=Element14; LCSC Part Number: C138021
R7 = RC0402FR-074K7L: RES 4.7K OHM 1% 1/16W 0402; Manufacturer: Yageo; Additional Feature: LASER TRIMMABLE; Power: 62.5mW; Rated Temperature: 70°C; Value: 4.7kR; Working Voltage: 50V; Temperature Coefficient (ppm/Cel): 100; Package Height: 0.35mm; Package Length: 1mm; Package Width: 0.5mm; Supplier: Future Electronics; Supplier Part Number: 3795218; Manufacturer Part Number: RC0402FR-074K7L; RoHS: Yes; Category: Chip SMD Resistors; Stock: 480000; Pricing: 10000=0.0004 (USD); Mounting Technology: Surface Mount; Pins: 2; Package Shape: Rectangular; Case/Package: 0402; Terminal Finish: Nickel; Min Operating Temperature: -55°C; Max Operating Temperature: 155°C; Tolerance: 1%; JESD-609 Code: e3; Resistor Type: FIXED RESISTOR; Construction: Chip; Packaging: Tape and Reel; Technology: METAL GLAZE/THICK FILM; Termination: Wraparound; Reach SVHC Compliant: Yes; RoHS Compliant: Yes; ComponentLink1URL: https://datasheet.ciiva.com:443/pdfs/VipMasterIC/IC/YAGO/YAGO-S-A0008145938/YAGO-S-A0008145938-1.pdf?src-supplier=IHS+Markit; ComponentLink1Description: https://datasheet.ciiva.com:443/pdfs/VipMasterIC/IC/YAGO/YAGO-S-A0008145938/YAGO-S-A0008145938-1.pdf?src-supplier=IHS+Markit; ComponentLink2URL: https://datasheet.ciiva.com/22661/1686128-22661342.pdf?src-supplier=Element14; ComponentLink2Description: https://datasheet.ciiva.com/22661/1686128-22661342.pdf?src-supplier=Element14; ComponentLink3URL: https://datasheet.ciiva.com/7850/1018594-7850022.pdf?src-supplier=Element14; ComponentLink3Description: https://datasheet.ciiva.com/7850/1018594-7850022.pdf?src-supplier=Element14; ComponentLink4URL: https://datasheet.ciiva.com/7850/1018594-7850023.pdf?src-supplier=Element14; ComponentLink4Description: https://datasheet.ciiva.com/7850/1018594-7850023.pdf?src-supplier=Element14; ComponentLink5URL: https://datasheet.ciiva.com/15215/getdatasheetpartid-328119-15215035.pdf?src-supplier=Verical; ComponentLink5Description: https://datasheet.ciiva.com/15215/getdatasheetpartid-328119-15215035.pdf?src-supplier=Verical; LCSC Part Number: C105871
R8 R9 = RC0402FR-071KL: RES 1K OHM 1% 1/16W 0402; Manufacturer: Yageo; Additional Feature: LASER TRIMMABLE; Power: 62.5mW; Rated Temperature: 70°C; Value: 1kR; Working Voltage: 50V; Temperature Coefficient (ppm/Cel): 100; Package Height: 0.35mm; Package Length: 1mm; Package Width: 0.5mm; Supplier: Future Electronics; Supplier Part Number: 7825607; Manufacturer Part Number: RC0402FR-071KL; RoHS: Yes; Category: Chip SMD Resistors; Stock: 4700000; Pricing: 10000=0.0004 (USD); Mounting Technology: Surface Mount; Pins: 2; Package Shape: Rectangular; Case/Package: 0402; Terminal Finish: Nickel; Min Operating Temperature: -55°C; Max Operating Temperature: 155°C; Tolerance: 1%; JESD-609 Code: e3; Resistor Type: FIXED RESISTOR; Construction: Chip; Packaging: Tape and Reel; Technology: METAL GLAZE/THICK FILM; Termination: Wraparound; Reach SVHC Compliant: Yes; RoHS Compliant: Yes; ComponentLink1URL: https://datasheet.ciiva.com:443/pdfs/VipMasterIC/IC/YAGO/YAGO-S-A0008145938/YAGO-S-A0008145938-1.pdf?src-supplier=IHS+Markit; ComponentLink1Description: https://datasheet.ciiva.com:443/pdfs/VipMasterIC/IC/YAGO/YAGO-S-A0008145938/YAGO-S-A0008145938-1.pdf?src-supplier=IHS+Markit; ComponentLink2URL: https://datasheet.ciiva.com/11819/0900766b80c66297-11819477.pdf?src-supplier=Rs; ComponentLink2Description: https://datasheet.ciiva.com/11819/0900766b80c66297-11819477.pdf?src-supplier=Rs; ComponentLink3URL: https://datasheet.ciiva.com/22747/1018594-22747513.pdf?src-supplier=Element14; ComponentLink3Description: https://datasheet.ciiva.com/22747/1018594-22747513.pdf?src-supplier=Element14; ComponentLink4URL: https://datasheet.ciiva.com/12666/pyu-rc0402-51-rohs-l-6-r-12666741.pdf?src-supplier=Mouser; ComponentLink4Description: https://datasheet.ciiva.com/12666/pyu-rc0402-51-rohs-l-6-r-12666741.pdf?src-supplier=Mouser; ComponentLink5URL: https://datasheet.ciiva.com/17063/pyu-rc0402-51-rohs-l-6-r-17063193.pdf?src-supplier=Future+Electronics; ComponentLink5Description: https://datasheet.ciiva.com/17063/pyu-rc0402-51-rohs-l-6-r-17063193.pdf?src-supplier=Future+Electronics; LCSC Part Number: C106235
R10 R13 R20-R22 = AC0402FR-0710KL: RES SMD 10K OHM 1% 1/16W 0402; Manufacturer: Yageo; Additional Feature: LASER TRIMMABLE; Power: 62.5mW; Rated Temperature: 70°C; Value: 10kR; Temperature Coefficient: 100ppm/°C; Working Voltage: 50V; Package Height: 0.32mm; Package Length: 1mm; Package Width: 0.5mm; Reference Standard: AEC-Q200; Supplier: Future Electronics; Supplier Part Number: 2025338; Manufacturer Part Number: AC0402FR-0710KL; RoHS: Yes; Category: Chip SMD Resistors; Stock: 38995000; Pricing: 10000=0.0022, 50000=0.002, 300000=0.0019, 1000000=0.0018, 3000000=0.0017 (USD); Mounting Technology: Surface Mount; Pins: 2; Package Shape: Rectangular; Case/Package: 0402; Terminal Finish: Nickel; Min Operating Temperature: -55°C; Max Operating Temperature: 155°C; Tolerance: 1%; JESD-609 Code: e3; Resistor Type: FIXED RESISTOR; Construction: Chip; Packaging: Tape and Reel; Technology: METAL GLAZE/THICK FILM; Termination: Wraparound; Reach SVHC Compliant: Yes; RoHS Compliant: Yes; ComponentLink1URL: https://datasheet.ciiva.com:443/pdfs/VipMasterIC/IC/YAGO/YAGO-S-A0003597364/YAGO-S-A0003597364-1.pdf?src-supplier=IHS+Markit; ComponentLink1Description: https://datasheet.ciiva.com:443/pdfs/VipMasterIC/IC/YAGO/YAGO-S-A0003597364/YAGO-S-A0003597364-1.pdf?src-supplier=IHS+Markit; ComponentLink2URL: https://datasheet.ciiva.com/12656/pyu-ac-51-rohs-l-2-12656634.pdf?src-supplier=Mouser; ComponentLink2Description: https://datasheet.ciiva.com/12656/pyu-ac-51-rohs-l-2-12656634.pdf?src-supplier=Mouser; LCSC Part Number: C144807
R11 R12 R14 R15 = AC0402FR-075K1L: RES SMD 5.1K OHM 1% 1/16W 0402; Manufacturer: Yageo; Additional Feature: LASER TRIMMABLE; Power: 62.5mW; Rated Temperature: 70°C; Value: 5.1kR; Working Voltage: 50V; Temperature Coefficient (ppm/Cel): 100; Package Height: 0.32mm; Package Length: 1mm; Package Width: 0.5mm; Reference Standard: AEC-Q200; Supplier: Future Electronics; Supplier Part Number: 8112408; Manufacturer Part Number: AC0402FR-075K1L; RoHS: Yes; Category: Chip SMD Resistors; Stock: 970000; Pricing: 10000=0.0005, 50000=0.0009, 100000=0.0005, 200000=0.0009, 300000=0.0005, 500000=0.0009, 750000=0.0005, 1250000=0.0009, 2000000=0.0005 (USD); Mounting Technology: Surface Mount; Pins: 2; Package Shape: Rectangular; Case/Package: 0402; Terminal Finish: Nickel; Min Operating Temperature: -55°C; Max Operating Temperature: 155°C; Tolerance: 1%; JESD-609 Code: e3; Resistor Type: FIXED RESISTOR; Construction: Chip; Packaging: Tape and Reel; Technology: METAL GLAZE/THICK FILM; Termination: Wraparound; Reach SVHC Compliant: Yes; RoHS Compliant: Yes; ComponentLink1URL: https://datasheet.ciiva.com:443/pdfs/VipMasterIC/IC/YAGO/YAGO-S-A0003597364/YAGO-S-A0003597364-1.pdf?src-supplier=IHS+Markit; ComponentLink1Description: https://datasheet.ciiva.com:443/pdfs/VipMasterIC/IC/YAGO/YAGO-S-A0003597364/YAGO-S-A0003597364-1.pdf?src-supplier=IHS+Markit; ComponentLink2URL: https://datasheet.octopart.com/AC0402FR-075K1L-Yageo-datasheet-166720450.pdf?src-supplier=Future+Electronics; ComponentLink2Description: https://datasheet.octopart.com/AC0402FR-075K1L-Yageo-datasheet-166720450.pdf?src-supplier=Future+Electronics; ComponentLink3URL: http://www.yageo.com/documents/recent/PYu-AC_51_RoHS_L_2_revised.pdf?src-supplier=Future+Electronics; ComponentLink3Description: http://www.yageo.com/documents/recent/PYu-AC_51_RoHS_L_2_revised.pdf?src-supplier=Future+Electronics; LCSC Part Number: C144745
SW1 SW2 = PTS645SK50SMTR92LFS: SWITCH TACTILE SPST-NO 0.05A 12V; Manufacturer: ITT C&K; Manufacturer Series: PTS645; Actuator Type: Pushbutton; Contact Current(DC)-Max: 50mA; Contact DC Max Rating R Load: 0.05A@12VDC; Contact Resistance: 0.1mR; Dielectric Withstand Volts: 250VACV; Insulation Resistance: 100GR; PCB Hole Count: 4; Switch Action: MOMENTARY; Switch Function: SPST; Switch Type: Keypad; Body Breadth: 5.9944mm; Body Height: 3.4544mm; Supplier: Digikey; Supplier Part Number: CKN9087CT-ND; Manufacturer Part Number: PTS645SK50SMTR92LFS; RoHS: Yes; Category: Tactile Switches; Stock: 52048; Pricing: 1=0.37, 10=0.299, 25=0.2748, 100=0.2425, 250=0.22292, 500=0.20906 (USD); Mounting Technology: Surface Mount; Terminal Finish: Silver; Min Operating Temperature: -20°C; Max Operating Temperature: 60°C; JESD-609 Code: e4; Contact Voltage(DC)-Max: 12V; Termination: Solder; Body Length or Diameter: 5.9944mm; Terminal Length: 0.138inch; Reach SVHC Compliant: Yes; RoHS Compliant: Yes; ComponentLink1URL: https://datasheet.ciiva.com:443/pdfs/VipMasterIC/IC/CKCI/CKCI-S-A0001796527/CKCI-S-A0001796842-1.pdf?src-supplier=IHS+Markit; ComponentLink1Description: https://datasheet.ciiva.com:443/pdfs/VipMasterIC/IC/CKCI/CKCI-S-A0001796527/CKCI-S-A0001796842-1.pdf?src-supplier=IHS+Markit; ComponentLink2URL: https://datasheet.ciiva.com/29903/getdatasheetpartid-741134-29903854.pdf?src-supplier=Verical; ComponentLink2Description: https://datasheet.ciiva.com/29903/getdatasheetpartid-741134-29903854.pdf?src-supplier=Verical; ComponentLink3URL: https://datasheet.ciiva.com/14920/pts645-14920581.pdf?src-supplier=Digikey; ComponentLink3Description: https://datasheet.ciiva.com/14920/pts645-14920581.pdf?src-supplier=Digikey; LCSC Part Number: C221872
U1 = ESP32-S3-MINI-1-N8: SMD module, ESP32-S3FN8, 8 MB SPI flash, PCB antenna; Manufacturer: Espressif Systems; Supplier: Digikey; Supplier Part Number: 1965-ESP32-S3-MINI-1-N8CT-ND; Manufacturer Part Number: ESP32-S3-MINI-1-N8; RoHS: No; Category: LDO; Stock: 7688; Pricing: 1=3.1, 650=3.10002 (USD); ComponentLink1URL: https://datasheet.octopart.com/ESP32-S3-MINI-1-N8-Espressif-Systems-datasheet-165560562.pdf?src-supplier=TME; ComponentLink1Description: https://datasheet.octopart.com/ESP32-S3-MINI-1-N8-Espressif-Systems-datasheet-165560562.pdf?src-supplier=TME; LCSC Part Number: C2913206
U2 = FT231XQ-R: IC USB SERIAL FULL UART 20QFN; Manufacturer: FTDI; Power Supplies: 3.3/5V; Max Supply Current: 8.4mA; Max Supply Voltage: 5.5V; Min Supply Voltage: 2.97V; Nominal Supply Voltage: 5V; Qualification Status: Not Qualified; Supplier: Digikey; Supplier Part Number: 768-1128-1-ND; Manufacturer Part Number: FT231XQ-R; RoHS: Yes; Category: Interface ICs; Stock: 54755; Pricing: 1=2.34, 25=2.27, 100=2.2, 250=2, 500=1.82002, 1000=1.7625 (USD); Case/Package: HVQCCN; Pins: 20; Package Shape: Square; Min Operating Temperature: -40°C; Max Operating Temperature: 85°C; JESD-30 Code: S-XQCC-N20; Package Style: CHIP CARRIER, HEAT SINK/SLUG, VERY THIN PROFILEMeter; Surface Mount: Yes; Technology: CMOS; Terminal Form: No Lead; Terminal Position: QUAD; Length: 4mm; Width: 4mm; Height - Seated (Max): 0.8mm; Terminal Pitch: 0.5mm; Temperature Grade: INDUSTRIAL; Reach SVHC Compliant: Yes; RoHS Compliant: Yes; ComponentLink1URL: https://datasheet.ciiva.com:443/pdfs/VipMasterIC/IC/FTDI/FTDIS00099/FTDIS00099-1.pdf?src-supplier=IHS+Markit; ComponentLink1Description: https://datasheet.ciiva.com:443/pdfs/VipMasterIC/IC/FTDI/FTDIS00099/FTDIS00099-1.pdf?src-supplier=IHS+Markit; ComponentLink2URL: https://datasheet.ciiva.com/1787/ds-ft231x-1787312.pdf?src-supplier=Digikey; ComponentLink2Description: https://datasheet.ciiva.com/1787/ds-ft231x-1787312.pdf?src-supplier=Digikey; ComponentLink3URL: https://datasheet.ciiva.com/4787/ds-ft231x-13571-4787570.pdf?src-supplier=Mouser; ComponentLink3Description: https://datasheet.ciiva.com/4787/ds-ft231x-13571-4787570.pdf?src-supplier=Mouser; ComponentLink4URL: https://datasheet.ciiva.com/30475/0900766b811020d3-30475405.pdf?src-supplier=Rs; ComponentLink4Description: https://datasheet.ciiva.com/30475/0900766b811020d3-30475405.pdf?src-supplier=Rs; ComponentLink5URL: https://datasheet.ciiva.com/1787/ft-x-series-1787313.pdf?src-supplier=Digikey; ComponentLink5Description: https://datasheet.ciiva.com/1787/ft-x-series-1787313.pdf?src-supplier=Digikey; ComponentLink6URL: https://datasheet.ciiva.com/1787/ft-x-series-1787314.pdf?src-supplier=Digikey; ComponentLink6Description: https://datasheet.ciiva.com/1787/ft-x-series-1787314.pdf?src-supplier=Digikey; LCSC Part Number: C132159
U3 = TL1963A-33DCYR: IC REG LINEAR 3.3V 1.5A SOT223-4; Manufacturer: Texas Instruments; Package Body Material: Plastic; Adjustability: FIXED; Dropout Voltage1-Max: 550mV; Dropout Voltage1-Nom: 340mV; Input Voltage Absolute-Max: 20V; Min Input Voltage: 3.8V; Channels: 1; Output Voltage1-Max: 3.4V; Output Voltage1-Min: 3.2V; Regulator Type: FIXED POSITIVE SINGLE OUTPUT LDO REGULATOR; Voltage Tolerance-Max: 3%; Qualification Status: Not Qualified; Supplier: Mouser; Supplier Part Number: 595-TL1963A-33DCYR; Manufacturer Part Number: TL1963A-33DCYR; RoHS: Yes; Category: Voltage Regulators - Linear; Stock: 11202; Pricing: 1=2.68, 10=1.89, 50=1.89, 100=1.71, 1000=1.52, 10000=1.46 (USD); Case/Package: SOP; Pins: 4; Package Shape: Rectangular; Terminal Finish: Tin; JESD-609 Code: e3; Max Supply Voltage: 20V; JESD-30 Code: R-PDSO-G4; Moisture Sensitivity Level: 2; Number of Outputs: 1; Operating Temperature, TJ-Max: 125°C; Operating Temperature, TJ-Min: -40°C; Output Current1-Max: 1.5A; Output Voltage1-Nom: 3.3V; Packaging: Tape and Reel; Peak Reflow Temperature (Cel): 260°C; Surface Mount: Yes; Technology: BIPOLAR; Terminal Form: Gull Wing; Terminal Position: DUAL; Length: 6.5mm; Width: 3.5mm; Height - Seated (Max): 1.8mm; Terminal Pitch: 2.3mm; Reach SVHC Compliant: Yes; RoHS Compliant: Yes; ComponentLink1URL: https://www.ti.com:443/lit/ds/symlink/tl1963a.pdf?src-supplier=IHS+Markit; ComponentLink1Description: https://www.ti.com:443/lit/ds/symlink/tl1963a.pdf?src-supplier=IHS+Markit; ComponentLink2URL: http://components.arrow.com/part/dataview/47593762S341822N7713?src-supplier=Arrow+Electronics; ComponentLink2Description: http://components.arrow.com/part/dataview/47593762S341822N7713?src-supplier=Arrow+Electronics; ComponentLink3URL: http://www.mouser.com/ds/2/405/slvs719g-522148.pdf?src-supplier=Mouser; ComponentLink3Description: http://www.mouser.com/ds/2/405/slvs719g-522148.pdf?src-supplier=Mouser; ComponentLink4URL: http://www.ti.com/general/docs/lit/getliterature.tsp?genericPartNumber=TL1963A-33&&fileType=pdf&src-supplier=Element14; ComponentLink4Description: http://www.ti.com/general/docs/lit/getliterature.tsp?genericPartNumber=TL1963A-33&&fileType=pdf&src-supplier=Element14; ComponentLink5URL: http://www.farnell.com/datasheets/1882025.pdf?src-supplier=Element14; ComponentLink5Description: http://www.farnell.com/datasheets/1882025.pdf?src-supplier=Element14; ComponentLink6URL: http://www.farnell.com/datasheets/1857366.pdf?src-supplier=Newark; ComponentLink6Description: http://www.farnell.com/datasheets/1857366.pdf?src-supplier=Newark; ComponentLink7URL: http://www.ti.com/general/docs/lit/getliterature.tsp?genericPartNumber=TL1963A-33&amp;&amp;fileType=pdf&src-supplier=Newark; ComponentLink7Description: http://www.ti.com/general/docs/lit/getliterature.tsp?genericPartNumber=TL1963A-33&amp;&amp;fileType=pdf&src-supplier=Newark; ComponentLink8URL: http://www.farnell.com/datasheets/2001646.pdf?src-supplier=Element14; ComponentLink8Description: http://www.farnell.com/datasheets/2001646.pdf?src-supplier=Element14; ComponentLink9URL: http://www.ti.com/general/docs/lit/getliterature.tsp?genericPartNumber=TL1963A-33&amp;&amp;fileType=pdf&src-supplier=Farnell; ComponentLink9Description: http://www.ti.com/general/docs/lit/getliterature.tsp?genericPartNumber=TL1963A-33&amp;&amp;fileType=pdf&src-supplier=Farnell; LCSC Part Number: C181262